# Altium schematic sheet Buck.SchDoc
size A; SheetNumber: 5; SheetTotal: 5
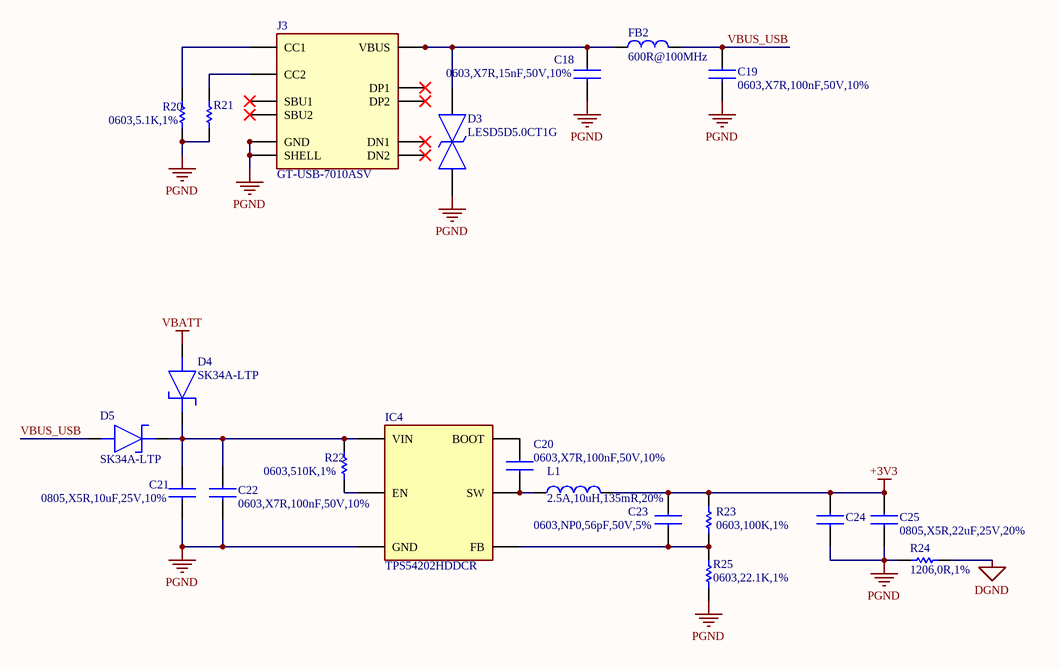
[diagram p0: Buck.SchDoc]

## Parts
C18  0603,X7R,15nF,50V,10%  [CAPC1608X90N]
C19  0603,X7R,100nF,50V,10%  [CAPC1608X90N]
C20  0603,X7R,100nF,50V,10%  [CAPC1608X90N]
C21  0805,X5R,10uF,25V,10%  [CAPC2012X145N]
C22  0603,X7R,100nF,50V,10%  [CAPC1608X90N]
C23  0603,NP0,56pF,50V,5%  [CAPC1608X90N]
C24  0805,X5R,22uF,25V,20%  [CAPC2012X145N]  (value not drawn)
C25  0805,X5R,22uF,25V,20%  [CAPC2012X145N]
D3  LESD5D5.0CT1G  [LESD5D50CT1G]
D4  SK34A-LTP  [SK34ALTP]
D5  SK34A-LTP  [SK34ALTP]
FB2  600R@100MHz  [L0603]
IC4  TPS54202HDDCR  [SOT95P280X100-6N]
J3  GT-USB-7010ASV  [USB-C-SMD_G-SWITCH_GT-USB-7010ASV]
L1  2.5A,10uH,135mR,20%  [IND-SMD_L3.0-W3.0_FTC303020D]
R20  0603,5.1K,1%  [RESC1608X55N]
R21  0603,5.1K,1%  [RESC1608X55N]  (value not drawn)
R22  0603,510K,1%  [RESC1608X55N]
R23  0603,100K,1%  [RESC1608X55N]
R24  1206,0R,1%  [RESC3116X65N]
R25  0603,22.1K,1%  [RESC1608X55N]

## Nets
+3V3: C23.2 C24.2 C25.2 L1.2 R23.2
DGND: R24.2
PGND: C18.1 C19.1 C21.1 C22.1 C24.1 C25.1 D3.1 IC4.1(GND) J3.1(SHELL) J3.2(SHELL) J3.3(SHELL) J3.4(SHELL) J3.A1B12(GND) J3.B1A12(GND) R20.1 R21.1 R24.1 R25.1
VBATT: D4.2(A)
VBUS_USB: C19.2 D5.2(A) FB2.2
NetC18_2: C18.2 D3.2 FB2.1 J3.A4B9(VBUS) J3.B4A9(VBUS)
NetC20_1: C20.1 IC4.2(SW) L1.1
NetC20_2: C20.2 IC4.6(BOOT)
NetC21_2: C21.2 C22.2 D4.1(K) D5.1(K) IC4.3(VIN) R22.2
NetC23_1: C23.1 IC4.4(FB) R23.1 R25.2
NetIC4_5: IC4.5(EN) R22.1
NetJ3_A5: J3.A5(CC1) R20.2
NetJ3_B5: J3.B5(CC2) R21.2

Not connected (* = marked no-connect by the designer): J3 A6(DP1)* A7(DN1)* A8(SBU1)* B6(DP2)* B7(DN2)* B8(SBU2)*

## Library data of the parts
C18 = CC0603KRX7R9BB153: 50V 15nF X7R ±10% 0603 Multilayer Ceramic Capacitors MLCC - SMD/SMT ROHS; Manufacturer_Name: YAGEO; Datasheet Link: https://componentsearchengine.com/Datasheets/2/CC0603KRX7R9BB104.pdf; Height: 0.9mm; Manufacturer_Part_Number: CC0603KRX7R9BB153; Mouser Part Number: 603-CC603KRX7R9BB104; Mouser Price/Stock: https://www.mouser.co.uk/ProductDetail/YAGEO/CC0603KRX7R9BB104?qs=vTakOoo5QyLvVCYM2ge8LQ%3D%3D; Arrow Part Number: CC0603KRX7R9BB104; Arrow Price/Stock: https://www.arrow.com/en/products/cc0603krx7r9bb104/yageo?utm_currency=USD&region=europe; LCSC Part #: C107076
C19 C20 C22 = CC0603KRX7R9BB104: 50V 100nF X7R ±10% 0603 Multilayer Ceramic Capacitors MLCC - SMD/SMT ROHS; Manufacturer_Name: YAGEO; Datasheet Link: https://componentsearchengine.com/Datasheets/2/CC0603KRX7R9BB104.pdf; Height: 0.9mm; Manufacturer_Part_Number: CC0603KRX7R9BB104; Mouser Part Number: 603-CC603KRX7R9BB104; Mouser Price/Stock: https://www.mouser.co.uk/ProductDetail/YAGEO/CC0603KRX7R9BB104?qs=vTakOoo5QyLvVCYM2ge8LQ%3D%3D; Arrow Part Number: CC0603KRX7R9BB104; Arrow Price/Stock: https://www.arrow.com/en/products/cc0603krx7r9bb104/yageo?utm_currency=USD&region=europe; LCSC Part #: C14663
C21 = CC0805KKX5R8BB106: 10 µF ±10% 25V Ceramic Capacitor X5R 0805 (2012 Metric); Manufacturer_Name: YAGEO; Datasheet Link: https://www.yageo.com/upload/media/product/productsearch/datasheet/mlcc/UPY-GPHC_X5R_4V-to-50V_27.pdf; Height: 1.45mm; Manufacturer_Part_Number: CC0805KKX5R8BB106; Mouser Part Number: 603-CC805KKX5R8BB106; Mouser Price/Stock: https://www.mouser.co.uk/ProductDetail/YAGEO/CC0805KKX5R8BB106?qs=57cj7OiSijm89pM64t1AGQ%3D%3D; Arrow Part Number: CC0805KKX5R8BB106; Arrow Price/Stock: https://www.arrow.com/en/products/cc0805kkx5r8bb106/yageo?utm_currency=USD&region=nac; LCSC Part #: C89831
C23 = CC0603JRNPO9BN560: 50V 56pF NP0 ±5% 0603 Ceramic Capacitors RoHS; Manufacturer_Name: YAGEO; Datasheet Link: https://www.yageo.com/upload/media/product/app/datasheet/mlcc/upy-gphc_x7r_6_3v-to-250v.pdf; Height: 0.95mm; Manufacturer_Part_Number: CC0603JRNPO9BN560; Mouser Part Number: 603-CC603KRX7R9BB105; Mouser Price/Stock: https://www.mouser.co.uk/ProductDetail/YAGEO/CC0603KRX7R9BB105?qs=6wERJjOp3mmF17%252BYi8cgJQ%3D%3D; Arrow Part Number: CC0603KRX7R9BB105; Arrow Price/Stock: https://www.arrow.com/en/products/cc0603krx7r9bb105/yageo?utm_currency=USD&region=nac; LCSC Part #: C107053
C24 C25 = CC0805MKX5R8BB226: 25V 22uF X5R ±20% 0805 Ceramic Capacitors RoHS; Manufacturer_Name: YAGEO; Datasheet Link: https://www.yageo.com/upload/media/product/productsearch/datasheet/mlcc/UPY-GPHC_X5R_4V-to-50V_27.pdf; Height: 1.45mm; Manufacturer_Part_Number: CC0805MKX5R8BB226; Mouser Part Number: 603-CC805KKX5R8BB106; Mouser Price/Stock: https://www.mouser.co.uk/ProductDetail/YAGEO/CC0805KKX5R8BB106?qs=57cj7OiSijm89pM64t1AGQ%3D%3D; Arrow Part Number: CC0805KKX5R8BB106; Arrow Price/Stock: https://www.arrow.com/en/products/cc0805kkx5r8bb106/yageo?utm_currency=USD&region=nac; LCSC Part #: C784585
D3 = LESD5D5.0CT1G: 9.4A 18.6V 5.6V Bidirectional 5V SOD-523 ESD and Surge Protection (TVS/ESD) ROHS; Manufacturer_Name: LRC; Height: 0.7mm; Manufacturer_Part_Number: LESD5D5.0CT1G; LCSC Part #: C383211
D4 D5 = SK34A-LTP: 80A 40V 500mV@3A 3A SMA(DO-214AC) Single Diodes RoHS; Manufacturer_Name: MCC; Datasheet Link: https://mccsemi.com/pdf/Products/SK32A-L-SK310A-L(DO-214AC).pdf; Height: 2.44mm; Manufacturer_Part_Number: SK34A-LTP; Mouser Part Number: 833-SK34A-LTP; Mouser Price/Stock: https://www.mouser.co.uk/ProductDetail/Micro-Commercial-Components-MCC/SK34A-LTP?qs=JeAkOuORR2VPwzg48d%252BVAA%3D%3D; Arrow Part Number: SK34A-LTP; Arrow Price/Stock: https://www.arrow.com/en/products/sk34a-ltp/micro-commercial-components?utm_currency=USD&region=nac; Manu Part #: SK34A-LTP; LCSC Part #: C85269
FB2 = BLM18AG601SN1D: 380mΩ ±25% 600Ω@100MHz 0603 Ferrite Beads ROHS; LCSC Part #: C19330
IC4 = TPS54202HDDCR: 500kHz 2A Buck Adjustable 596mV~28V 1 TSOT-23-6 Voltage Regulators - DC DC Switching Regulators RoHS; Manufacturer_Name: Texas Instruments; Datasheet Link: http://www.ti.com/lit/gpn/tps54202h; Height: 1.1mm; Manufacturer_Part_Number: TPS54202HDDCR; Mouser Part Number: 595-TPS54202HDDCR; Mouser Price/Stock: https://www.mouser.co.uk/ProductDetail/Texas-Instruments/TPS54202HDDCR?qs=uP22XH7NdCtzy%252BOdxI8qhQ%3D%3D; Arrow Part Number: TPS54202HDDCR; Arrow Price/Stock: https://www.arrow.com/en/products/tps54202hddcr/texas-instruments?utm_currency=USD&region=europe; Manu Part #: TPS54202HDDCR; LCSC Part #: C527684
J3 = GT-USB-7010ASV: USB 2.0 3A 1 Surface Mount, Right Angle 16P Female -40℃~+85℃ Type-C SMD USB Connectors ROHS; LCSC Part #: C2988369; Manu Part #: GT-USB-7010ASV
L1 = FTC303020D100MBCA: 2.5A 10uH ±20% 3.8A 135mΩ SMD,3x3mm Fixed Inductors RoHS; Manu Part #: FTC303020D100MBCA; LCSC Part #: C7423323
R20 R21 = RC0603FR-075K1L: 100mW 5.1kΩ 75V ±100ppm/℃ Thick Film Resistor ±1% 0603 Chip Resistor - Surface Mount RoHS; Manufacturer_Name: YAGEO; Datasheet Link: https://www.mouser.com/catalog/specsheets/YAGEO_PYu_RC_Group_51_RoHS_L_12.pdf; Height: 0.55mm; Manufacturer_Part_Number: RC0603FR-075K1L; LCSC Part #: C105580
R22 = RC0603FR-07510KL: 100mW 510kΩ 75V ±100ppm/℃ Thick Film Resistor ±1% 0603 Chip Resistor - Surface Mount RoHS; Manufacturer_Name: YAGEO; Datasheet Link: https://www.mouser.com/catalog/specsheets/YAGEO_PYu_RC_Group_51_RoHS_L_12.pdf; Height: 0.55mm; Manufacturer_Part_Number: RC0603FR-07510KL; LCSC Part #: C114066; Manu Part #: RC0603FR-07510KL
R23 = RC0603FR-07100KL: 100mW Thick Film Resistor 75V ±100ppm/℃ ±1% 100kΩ 0603 Chip Resistor - Surface Mount ROHS; Manufacturer_Name: YAGEO; Datasheet Link: https://www.mouser.com/catalog/specsheets/YAGEO_PYu_RC_Group_51_RoHS_L_12.pdf; Height: 0.55mm; Manufacturer_Part_Number: RC0603FR-07100KL; LCSC Part #: C14675
R24 = RC1206FR-070RL: 0Ω 250mW 200V Thick Film Resistor ±1% 1206 Chip Resistor - Surface Mount RoHS; Manufacturer_Name: YAGEO; Datasheet Link: https://www.yageogroup.com/content/datasheet/asset/file/PYU-RC_GROUP_51_ROHS_L; Height: 0.65mm; Manufacturer_Part_Number: RC1206FR-070RL; Mouser Part Number: 603-RC1206FR-070RL; Mouser Price/Stock: https://www.mouser.co.uk/ProductDetail/YAGEO/RC1206FR-070RL?qs=%2FbpERZPLKKvgeF8VBtNQLg%3D%3D; Arrow Part Number: RC1206FR-070RL; Arrow Price/Stock: https://www.arrow.com/en/products/rc1206fr-070rl/yageo?region=nac; Manu Part #: RC1206FR-070RL; LCSC Part #: C137394
R25 = RC0603FR-0722K1L: 22.1kΩ 100mW 75V ±100ppm/℃ Thick Film Resistor ±1% 0603 Chip Resistor - Surface Mount RoHS; Manufacturer_Name: YAGEO; Datasheet Link: https://www.mouser.com/catalog/specsheets/YAGEO_PYu_RC_Group_51_RoHS_L_12.pdf; Height: 0.55mm; Manufacturer_Part_Number: RC0603FR-0722K1L; LCSC Part #: C137768